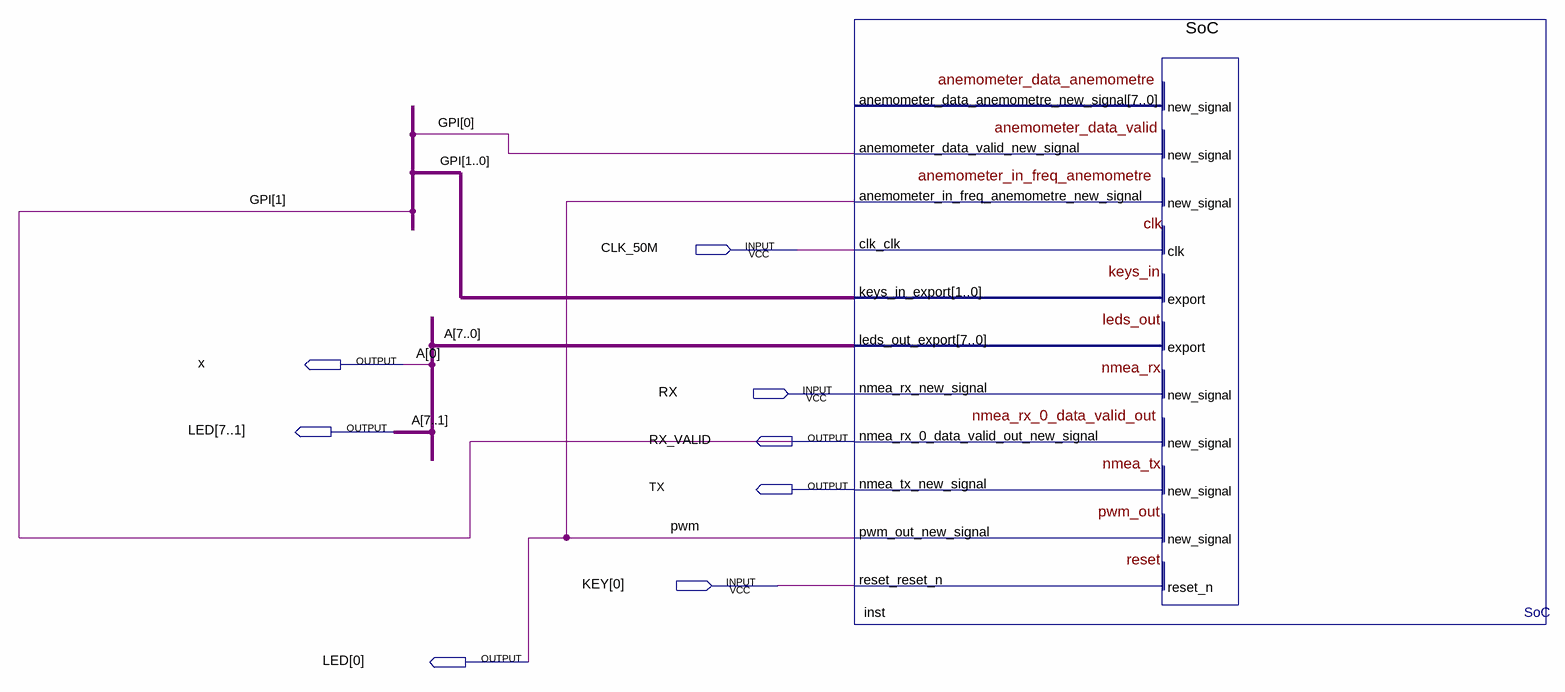
[diagram p0: schematic sheet]
// Quartus schematic HW.bdf as structural Verilog: 1 symbols, 8 pins
module HW (
  input  CLK_50M,
  input  RX,
  input  [0:0] KEY,
  output x,
  output [7:0] LED,
  output RX_VALID,
  output TX
);

  wire [0:0] GPI;

  SoC inst (
    .anemometer_in_freq_anemometre_new_signal(LED[0]), .clk_clk(CLK_50M),
    .keys_in_export({RX_VALID, GPI[0]}), .nmea_rx_new_signal(RX), .reset_reset_n(KEY[0]),
    .anemometer_data_valid_new_signal(GPI[0]), .leds_out_export({LED[7:1], x}),
    .nmea_rx_0_data_valid_out_new_signal(RX_VALID), .nmea_tx_new_signal(TX), .pwm_out_new_signal(LED[0]));  // open: anemometer_data_anemometre_new_signal

  // Other names for the same wires on the sheet: A[7:0] = {LED[7:1], x}; pwm = LED[0]; GPI[1] = RX_VALID
endmodule
